# EAGLE design project2 (EAGLE 9.6.2)
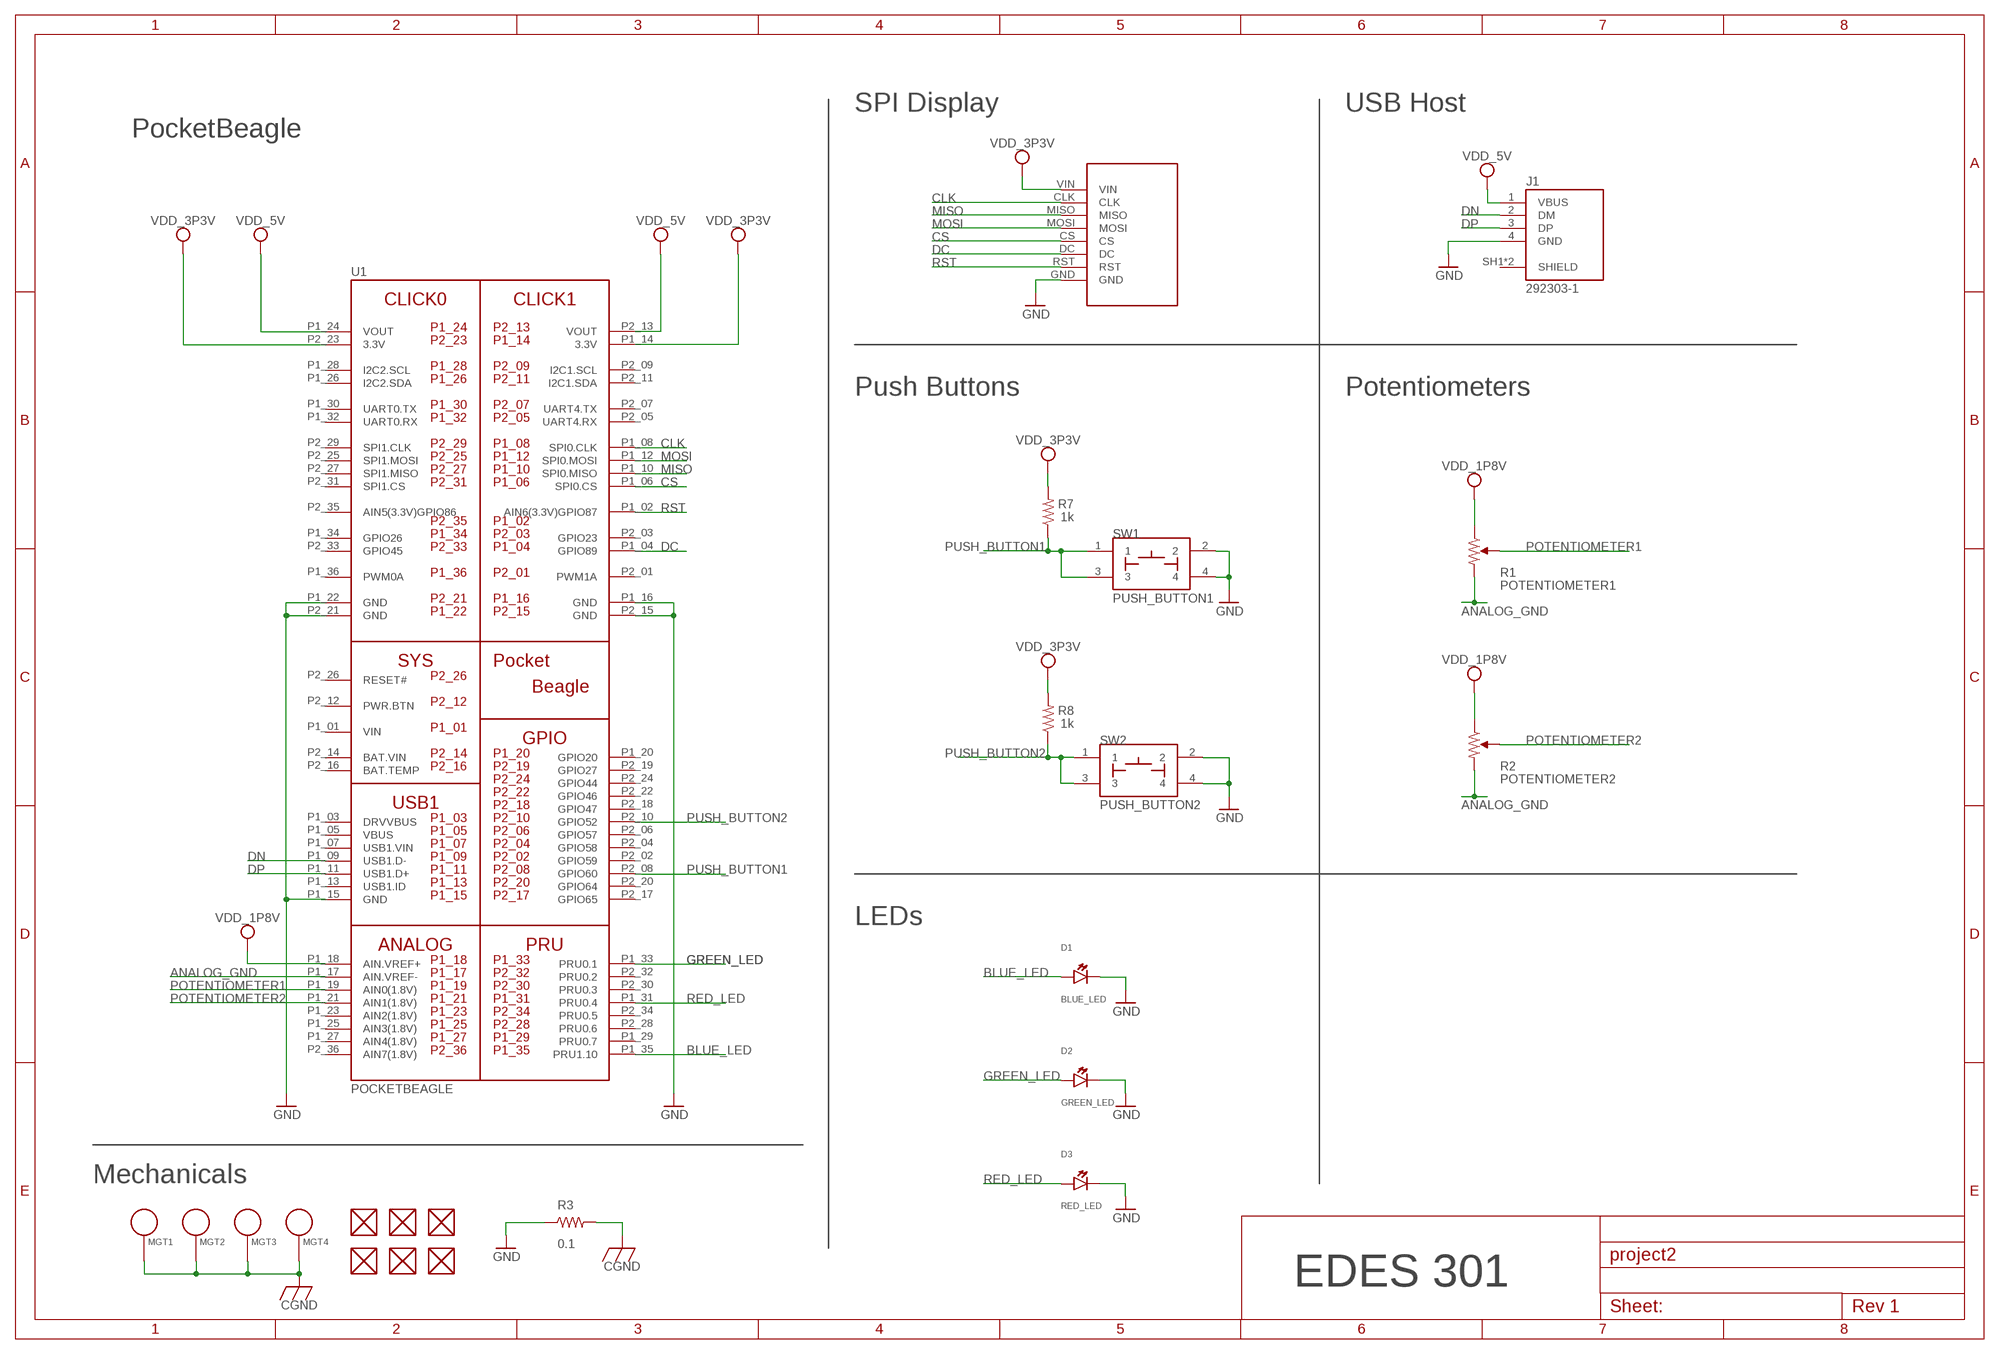
[diagram p0: schematic, sheet 1]

## Parts
D1  BLUE_LED  LED  [EIA-STD]
D2  GREEN_LED  LED  [EIA-STD]
D3  RED_LED  LED  [EIA-STD]
FUD1  FIDUCIAL  [FIDUCIAL_40MIL]
FUD2  FIDUCIAL  [FIDUCIAL_40MIL]
FUD3  FIDUCIAL  [FIDUCIAL_40MIL]
FUD4  FIDUCIAL  [FIDUCIAL_40MIL]
FUD5  FIDUCIAL  [FIDUCIAL_40MIL]
FUD6  FIDUCIAL  [FIDUCIAL_40MIL]
J1  292303-1  [TE_292303-1]
MGT1  MOUNTING_HOLE  [MOUNTING_HOLE]
MGT2  MOUNTING_HOLE  [MOUNTING_HOLE]
MGT3  MOUNTING_HOLE  [MOUNTING_HOLE]
MGT4  MOUNTING_HOLE  [MOUNTING_HOLE]
R1  POTENTIOMETER1  POTENTIOMETER  [POT-PO90S]
R2  POTENTIOMETER2  POTENTIOMETER  [POT-PO90S]
R3  0.1  R_R0805  [R0805]
R7  1k  R_R0603  [R0603]
R8  1k  R_R0603  [R0603]
SW1  PUSH_BUTTON1  PUSH_BUTTON  [BUTTON_12.5MM]
SW2  PUSH_BUTTON2  PUSH_BUTTON  [BUTTON_12.5MM]
U1  POCKETBEAGLE  [POCKETBEAGLE]
U$1  SCREEN  [SCREEN]

## Nets
ANALOG_GND: R1.CW R2.CW U1.P1_17(AIN.VREF-)
BLUE_LED: D1.ANODE U1.P1_35(PRU1.10)
CGND: MGT1.P$1 MGT2.P$1 MGT3.P$1 MGT4.P$1 R3.2
CLK: U1.P1_08(SPI0.CLK) U$1.CLK
CS: U1.P1_06(SPI0.CS) U$1.CS
DC: U1.P1_04(GPIO89) U$1.DC
DN: J1.2(DM) U1.P1_09(USB1.D-)
DP: J1.3(DP) U1.P1_11(USB1.D+)
GND: D2.CATHODE D3.CATHODE J1.4(GND) R3.1 SW1.2 SW1.4 SW2.2 SW2.4 U1.P1_15(GND) U1.P1_16(GND) U1.P1_22(GND) U1.P2_15(GND) U1.P2_21(GND) U$1.GND
GREEN_LED: D2.ANODE U1.P1_33(PRU0.1)
MISO: U1.P1_10(SPI0.MISO) U$1.MISO
MOSI: U1.P1_12(SPI0.MOSI) U$1.MOSI
N$1: D1.CATHODE ; supply symbol labelled GND
N$8: R7.2 ; supply symbol labelled VDD_3P3V
N$15: U1.P1_18(AIN.VREF+) ; supply symbol labelled VDD_1P8V
POTENTIOMETER1: R1.S U1.P1_19(AIN0(1.8V))
POTENTIOMETER2: R2.S U1.P1_21(AIN1(1.8V))
PUSH_BUTTON1: R7.1 SW1.1 SW1.3 U1.P2_08(GPIO60)
PUSH_BUTTON2: R8.1 SW2.1 SW2.3 U1.P2_10(GPIO52)
RED_LED: D3.ANODE U1.P1_31(PRU0.4)
RST: U1.P1_02(AIN6(3.3V)GPIO87) U$1.RST
VDD_1P8V: R1.CCW R2.CCW
VDD_3P3V: R8.2 U1.P1_14(3.3V) U1.P2_23(3.3V) U$1.VIN
VDD_5V: J1.1(VBUS) U1.P1_24(VOUT) U1.P2_13(VOUT)
Unconnected: FUD1.P$1 FUD2.P$1 FUD3.P$1 FUD4.P$1 FUD5.P$1 FUD6.P$1 J1.SH1(SHIELD) J1.SH2(SHIELD) U1.P1_03(DRVVBUS) U1.P1_05(VBUS) U1.P1_07(USB1.VIN) U1.P1_13(USB1.ID) U1.P1_20(GPIO20) U1.P1_23(AIN2(1.8V)) U1.P1_25(AIN3(1.8V)) U1.P1_26(I2C2.SDA) U1.P1_27(AIN4(1.8V)) U1.P1_28(I2C2.SCL) U1.P1_29(PRU0.7) U1.P1_30(UART0.TX) U1.P1_32(UART0.RX) U1.P1_34(GPIO26) U1.P1_36(PWM0A) U1.P2_01(PWM1A) U1.P2_02(GPIO59) U1.P2_03(GPIO23) U1.P2_04(GPIO58) U1.P2_05(UART4.RX) U1.P2_06(GPIO57) U1.P2_07(UART4.TX) U1.P2_09(I2C1.SCL) U1.P2_11(I2C1.SDA) U1.P2_12(PWR.BTN) U1.P2_16(BAT.TEMP) U1.P2_17(GPIO65) U1.P2_18(GPIO47) U1.P2_19(GPIO27) U1.P2_20(GPIO64) U1.P2_22(GPIO46) U1.P2_24(GPIO44) U1.P2_25(SPI1.MOSI) U1.P2_26(RESET#) U1.P2_27(SPI1.MISO) U1.P2_28(PRU0.6) U1.P2_29(SPI1.CLK) U1.P2_30(PRU0.3) U1.P2_31(SPI1.CS) U1.P2_32(PRU0.2) U1.P2_33(GPIO45) U1.P2_34(PRU0.5) U1.P2_35(AIN5(3.3V)GPIO86) U1.P2_36(AIN7(1.8V))

## Notes on the sheet
- SPI Display | USB Host
- PocketBeagle
- Push Buttons | Potentiometers
- LEDs
- Mechanicals
- EDES 301

## Power pins joined to a net without a drawn wire
BAT.VIN: U1.P2_14(BAT.VIN)
VIN: U1.P1_01(VIN)

## Library data of the parts
D1-D3 = combo_lock (1):LED: EIA-STD LED, LTST-C191TBKT
FUD1-FUD6 = combo_lock (1):FIDUCIAL
J1 = combo_lock (1):292303-1: CONN USB RECEPT R/A TYPE A 4POS Check availability <https://pricing.snapeda.com/parts/292303-1/TE%20Connectivity/view-part?ref=eda>; AVAILABILITY: In Stock; CENTERLINE_PITCH: 2 mm[.078 in]; COMMENT: 292303-1; DESCRIPTION: Conn; Data; USB; Recept; 2.0; 4 Pos; 1 Port; Rt Angle; A Ser; Tin over Copper; EU_ROHS_COMPLIANCE: Compliant; MF: TE Connectivity; MP: 292303-1; NUMBER_OF_POSITIONS: 4; PACKAGE: None; PRICE: None; PRODUCT_TYPE: Connector; PURCHASE-URL: https://pricing.snapeda.com/search/part/292303-1/?ref=eda
MGT1-MGT4 = combo_lock (1):MOUNTING_HOLE: Chassis Mounting Hole w/GND connection ability
R1 R2 = combo_lock (1):POTENTIOMETER: Potentiometer - Examples: P090S-14T20BR10K (987-1277-ND)
R3 R7 R8 = combo_lock (1):R_: RESISTOR, American symbol
SW1 SW2 = combo_lock (1):PUSH_BUTTON
U1 = combo_lock (1):POCKETBEAGLE
U$1 = combo_lock (1):SCREEN

## Board
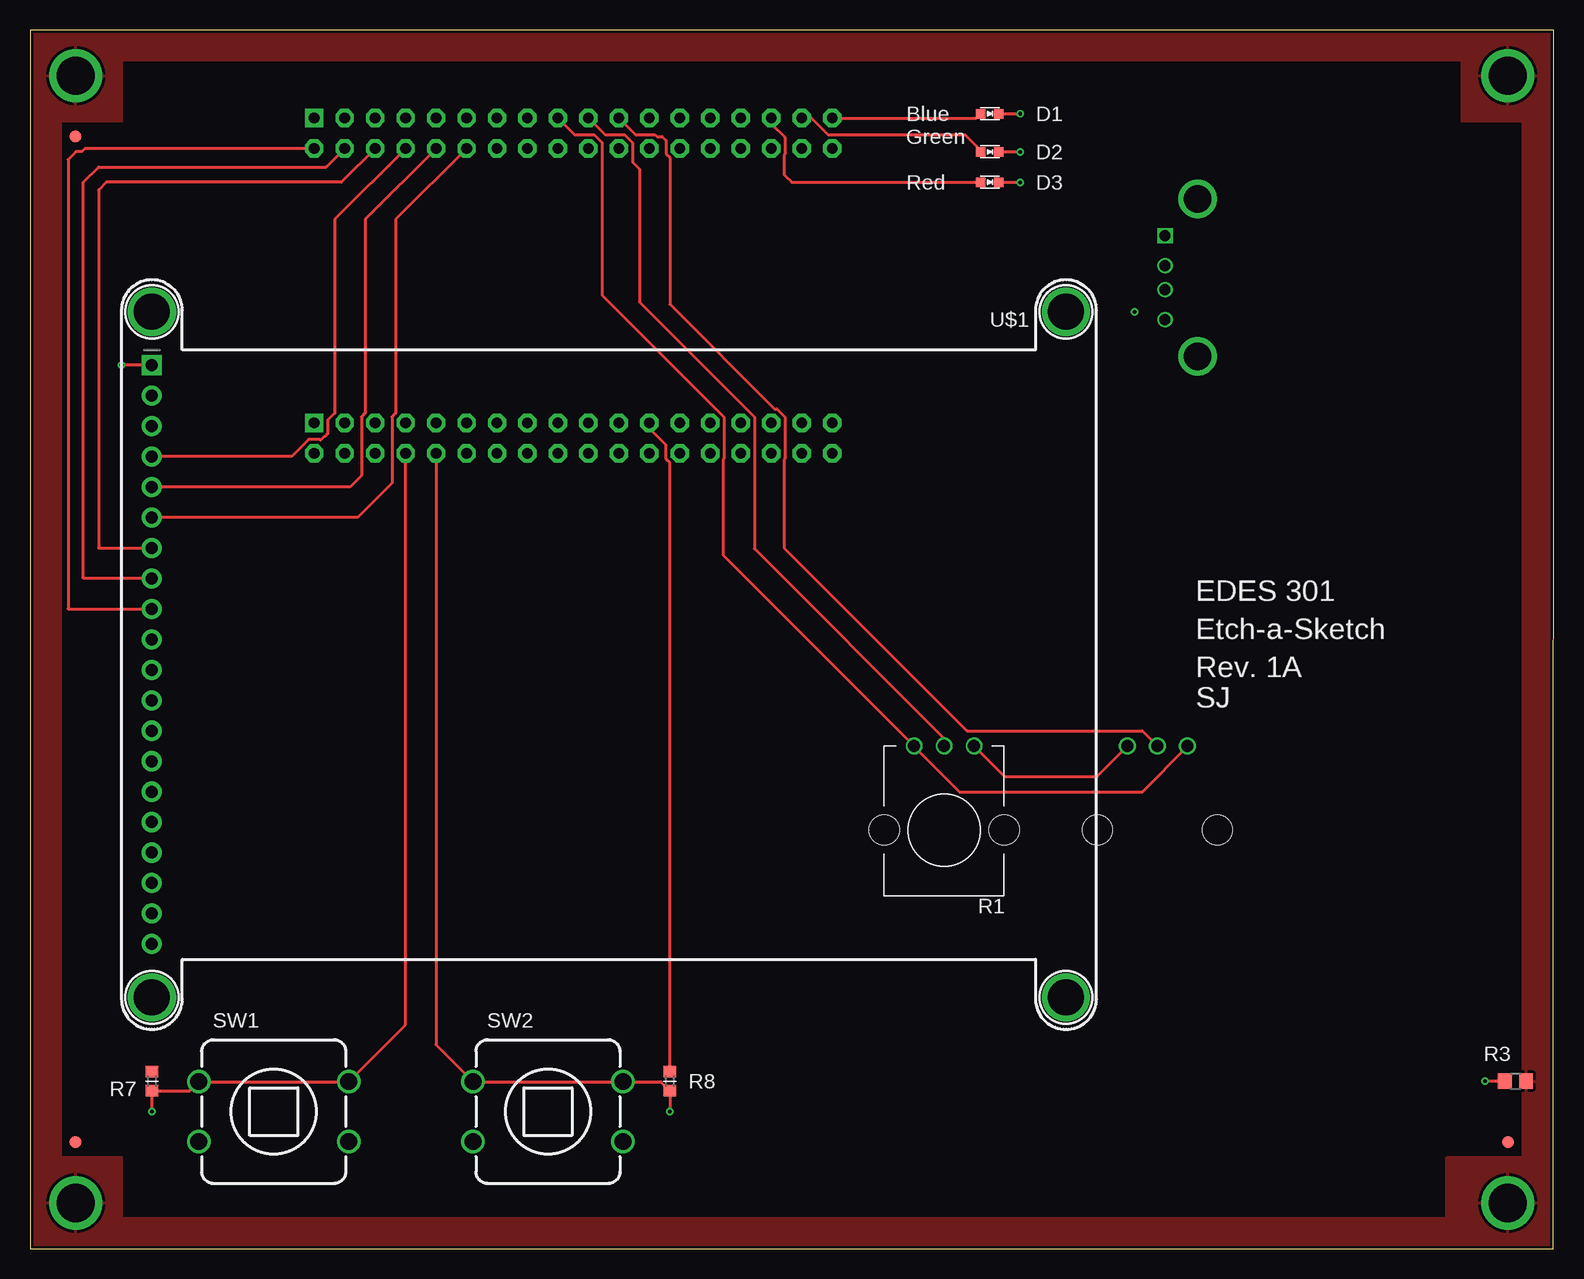
[diagram p1: board, top side]
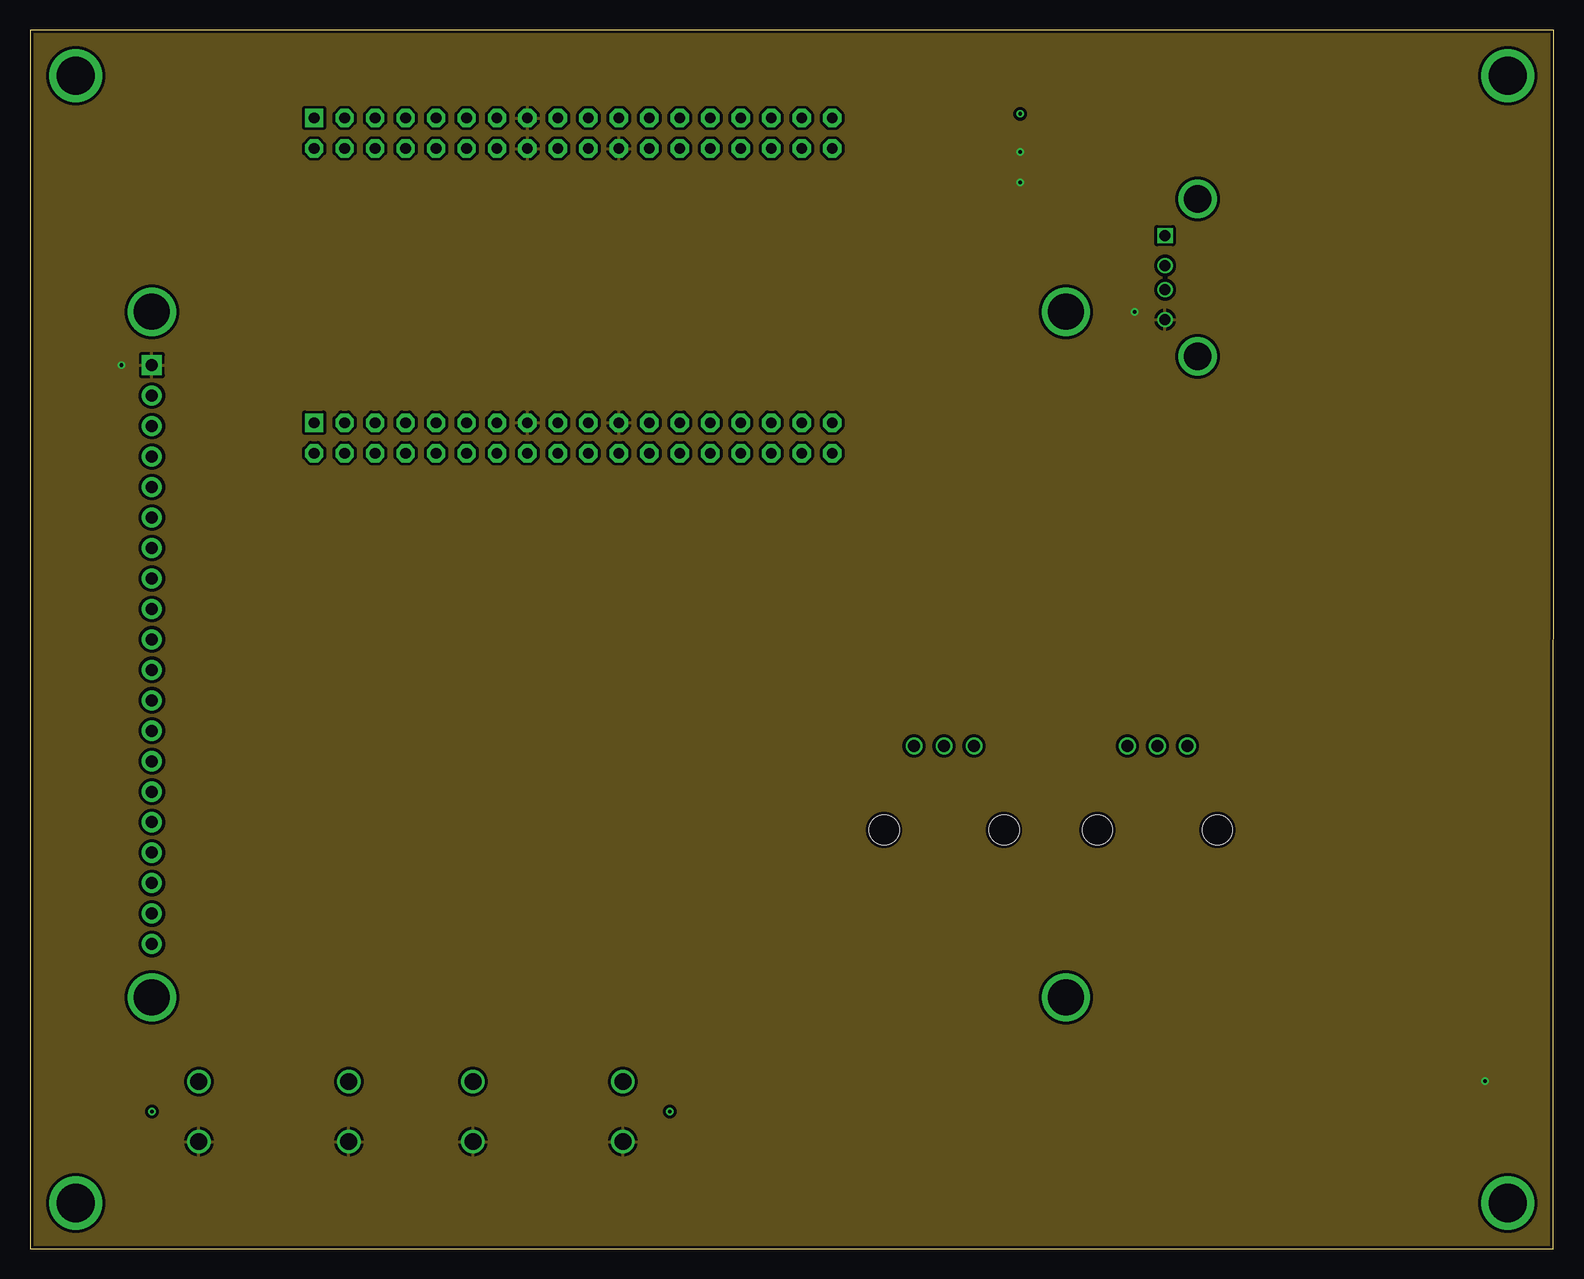
[diagram p2: board, inner layer Route2]
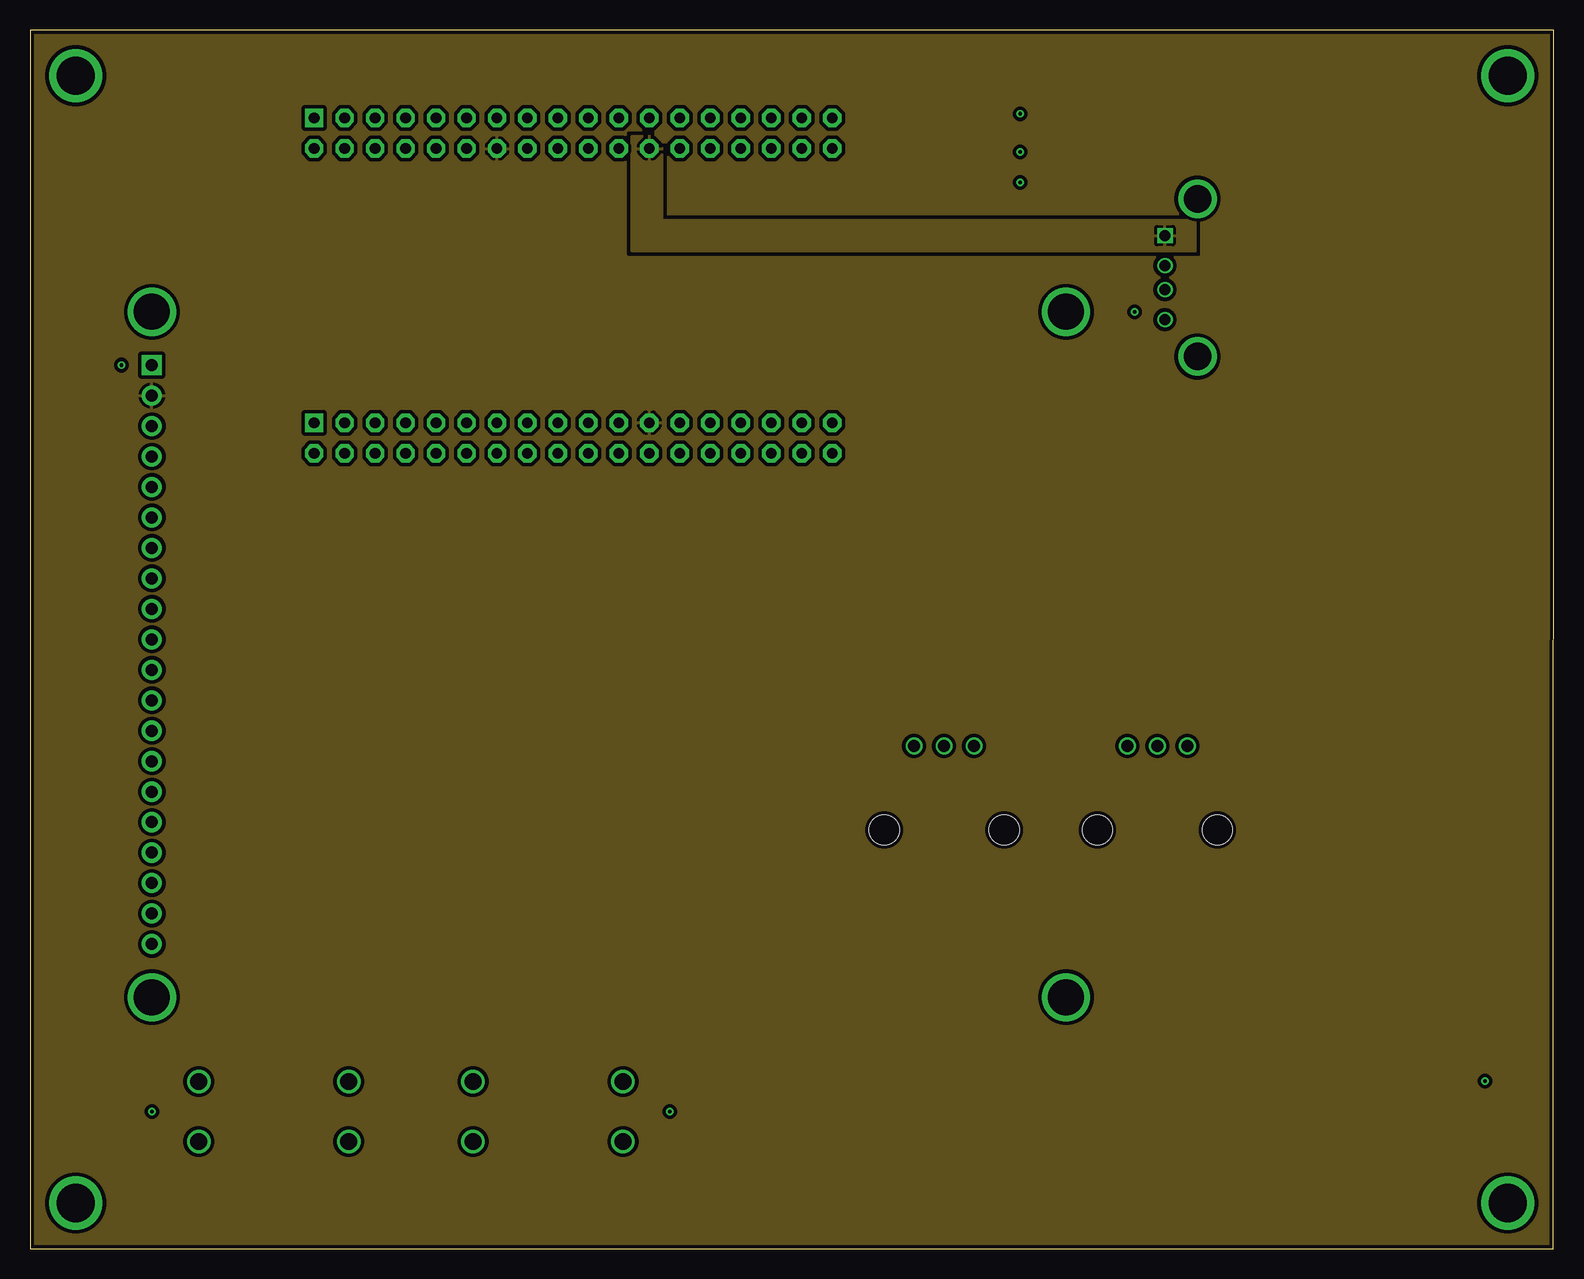
[diagram p3: board, inner layer Route15]
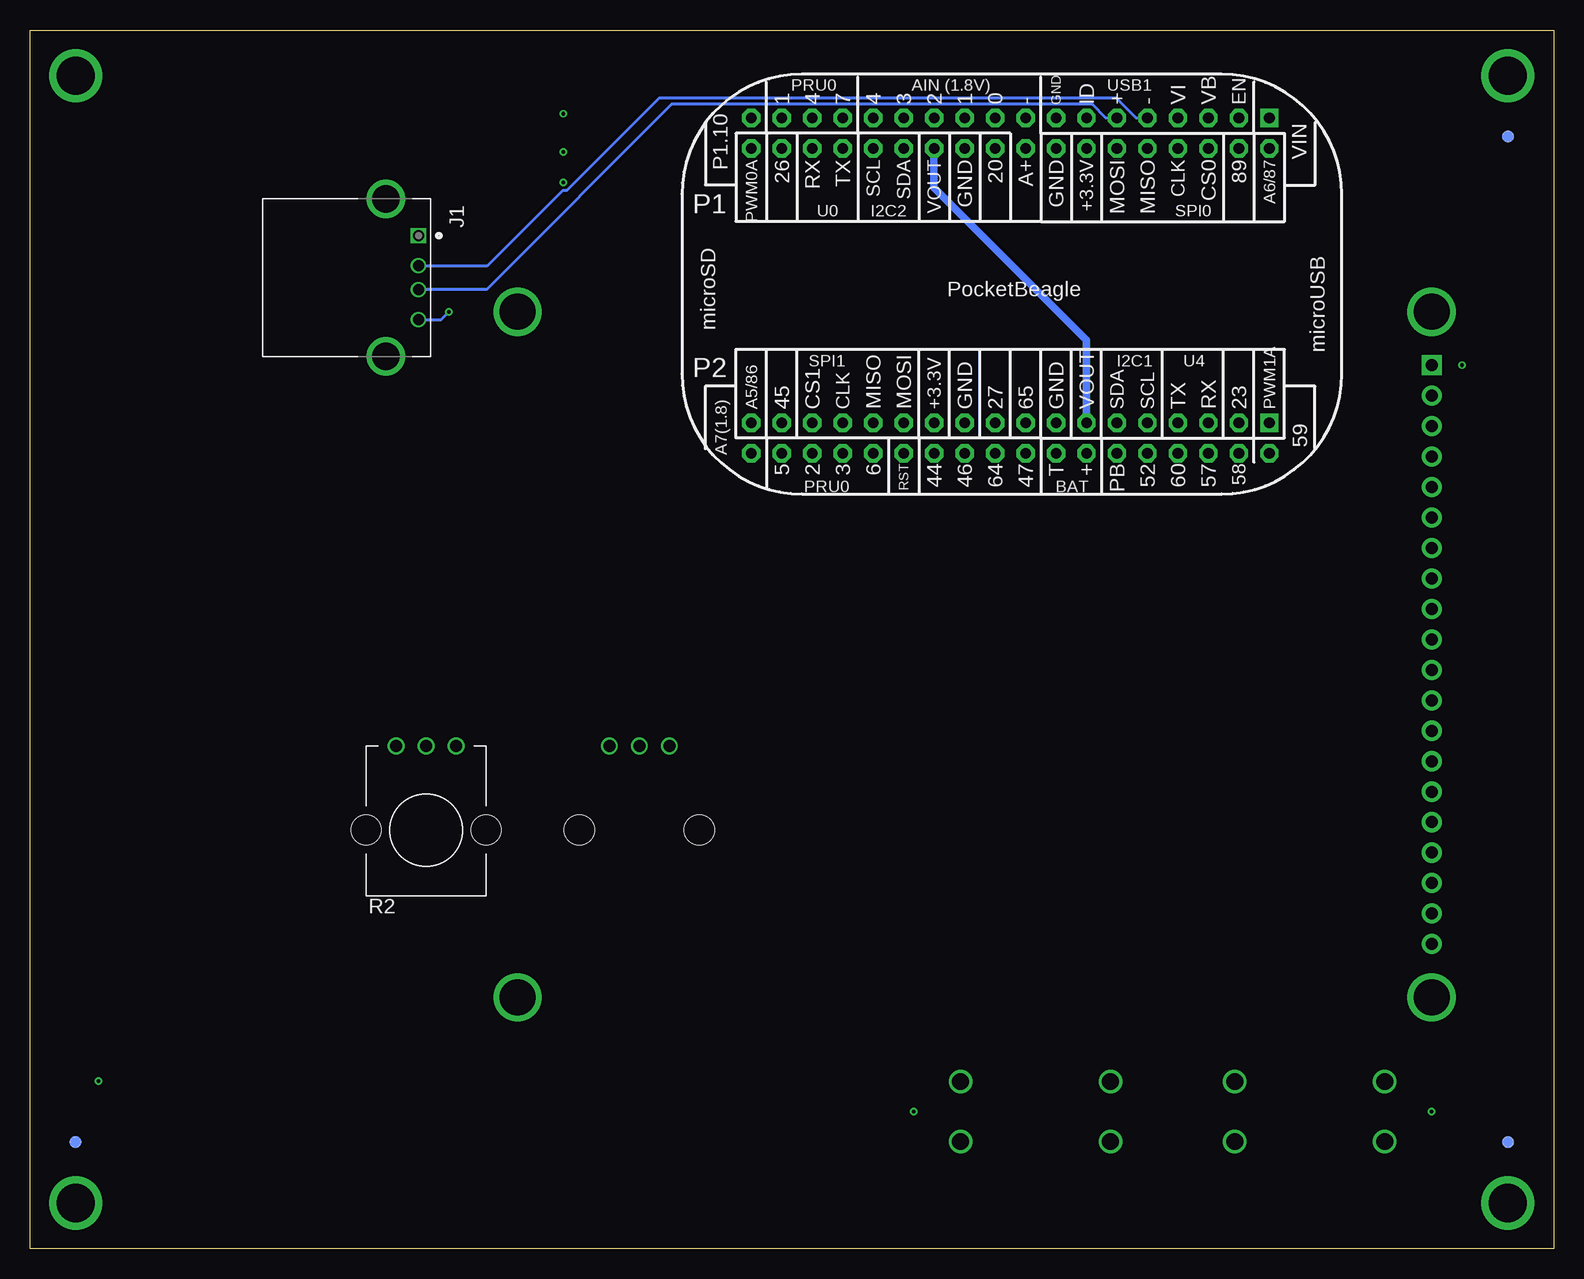
[diagram p4: board, bottom side, seen from below]

Size 127 x 101.6 mm. Coordinates in mm from the lower left corner, seen from the top.
Outline: 0,0 126.98,0 127,101.6 0,101.6 0,0
Copper layers (1*2*15*16): Top 0.035mm / dielectric 0.23mm / Route2 0.035mm / dielectric 0.93mm / Route15 0.035mm / dielectric 0.23mm / Bottom 0.035mm
Design rules "EDES301_4lyr (1)": minimum track width 10mil, minimum drill 12mil, track to track 10mil, track to pad 10mil, pad to pad 10mil, via to via 10mil, smd to smd 10mil, copper to edge 10mil, drill to drill 12mil, minimum pad ring 6mil, minimum via ring 6mil, stop-mask expansion 3mil, vias tented up to drill 25mil, thermal gap 10mil

### Footprints (pad centres in the part's own frame; a part is rotated, then mirrored left to right if it is on the bottom)
EIA-STD = smd 0.8 x 0.8: ANODE -0.75,0; CATHODE 0.75,0
FIDUCIAL_40MIL = smd 1.016 x 1.016: P$1 0,0
TE_292303-1 = drill 0.92 square: 1 0,0 | drill 0.92: 2 2.5,0; 3 4.5,0; 4 7,0 | drill 2.3: SH1 -3.07,-2.71; SH2 10.07,-2.71
MOUNTING_HOLE = drill 3.175 pad 4.445: P$1 0,0
POT-PO90S = drill 1: CCW -2.5,0; CW 2.5,0; S 0,0 | hole 2.5: -5,7; 5,7
R0805 = smd 1.143 x 1.27: 1 -0.889,0; 2 0.889,0
R0603 = smd 0.95 x 1.031: 1 -0.8,0; 2 0.8,0
BUTTON_12.5MM = drill 1.4: 1 -6.25,2.5; 2 -6.25,-2.5; 3 6.25,2.5; 4 6.25,-2.5
POCKETBEAGLE = drill 0.889 pad 1.524 square: P1_01 5.91,3.53; P2_01 5.91,28.93 | drill 0.889 pad 1.524 octagon: P1_02 5.91,6.07; P1_03 8.45,3.53; P1_04 8.45,6.07; P1_05 10.99,3.53; P1_06 10.99,6.07; P1_07 13.53,3.53; P1_08 13.53,6.07; P1_09 16.07,3.53; P1_10 16.07,6.07; P1_11 18.61,3.53; P1_12 18.61,6.07; P1_13 21.15,3.53; P1_14 21.15,6.07; P1_15 23.69,3.53; P1_16 23.69,6.07; P1_17 26.23,3.53; P1_18 26.23,6.07; P1_19 28.77,3.53; P1_20 28.77,6.07; P1_21 31.31,3.53; P1_22 31.31,6.07; P1_23 33.85,3.53; P1_24 33.85,6.07; P1_25 36.39,3.53; P1_26 36.39,6.07; P1_27 38.93,3.53; P1_28 38.93,6.07; P1_29 41.47,3.53; P1_30 41.47,6.07; P1_31 44.01,3.53; P1_32 44.01,6.07; P1_33 46.55,3.53; P1_34 46.55,6.07; P1_35 49.09,3.53; P1_36 49.09,6.07; P2_02 5.91,31.47; P2_03 8.45,28.93; P2_04 8.45,31.47; P2_05 10.99,28.93; P2_06 10.99,31.47; P2_07 13.53,28.93; P2_08 13.53,31.47; P2_09 16.07,28.93; P2_10 16.07,31.47; P2_11 18.61,28.93; P2_12 18.61,31.47; P2_13 21.15,28.93; P2_14 21.15,31.47; P2_15 23.69,28.93; P2_16 23.69,31.47; P2_17 26.23,28.93; P2_18 26.23,31.47; P2_19 28.77,28.93; P2_20 28.77,31.47; P2_21 31.31,28.93; P2_22 31.31,31.47; P2_23 33.85,28.93; P2_24 33.85,31.47; P2_25 36.39,28.93; P2_26 36.39,31.47; P2_27 38.93,28.93; P2_28 38.93,31.47; P2_29 41.47,28.93; P2_30 41.47,31.47; P2_31 44.01,28.93; P2_32 44.01,31.47; P2_33 46.55,28.93; P2_34 46.55,31.47; P2_35 49.09,28.93; P2_36 49.09,31.47
SCREEN = drill 1 pad 1.676: 3VO -19.05,-38.1; 12@JP2 3.81,-38.1; 13@JP2 6.35,-38.1; 14@JP2 8.89,-38.1; 15@JP2 11.43,-38.1; 16@JP2 13.97,-38.1; 17@JP2 16.51,-38.1; 18@JP2 19.05,-38.1; 19@JP2 21.59,-38.1; 20@JP2 24.13,-38.1; CLK -16.51,-38.1; CS -8.89,-38.1; DC -6.35,-38.1; GND@1 1.27,-38.1; LITE -1.27,-38.1; MISO -13.97,-38.1; MOSI -11.43,-38.1; RST -3.81,-38.1; VIN -21.59,-38.1 | drill 1 pad 1.676 square: GND -24.13,-38.1 | drill 3 pad 3.6: P$1@U$7 -28.575,-38.1; P$1@U$15 28.575,-38.1; P$1@U$16 -28.575,38.1; P$1@U$17 28.575,38.1

### Placement (x,y rotation side)
D1  80.01,94.61 0 top
D2  80.01,91.44 0 top
D3  80.01,88.9 0 top
FUD1  3.81,8.89 0 top
FUD2  3.81,92.71 0 top
FUD3  123.19,8.89 0 top
FUD4  3.81,8.89 0 bottom
FUD5  3.81,92.71 0 bottom
FUD6  123.19,8.89 0 bottom
J1  94.61,84.45 270 bottom
MGT1  3.81,3.81 0 top
MGT2  3.81,97.79 0 top
MGT3  123.19,97.79 0 top
MGT4  123.19,3.81 0 top
R1  76.2,41.91 180 top
R2  93.98,41.91 180 bottom
R3  123.83,13.97 0 top
R7  10.16,13.97 90 top
R8  53.34,13.97 90 top
SW1  20.32,11.43 0 top
SW2  43.18,11.43 0 top
U1  17.78,97.79 180 bottom
U$1  48.26,49.53 270 top

### Tracks (layer width: path | path; a pad name or v marks a point on that pad's centre or on a via)
ANALOG_GND
  Top 0.254: U1.P1_17 45.41,92.86 47.02,92.86 47.69,92.19 47.69,79.49 57.85,69.33 57.85,65.85 57.78,65.78 57.78,57.83 R1.CW 73.7,41.87 77.47,38.1 92.71,38.1 96.48,41.87 R2.CW
BLUE_LED
  Top 0.254: U1.P1_35 78.91,94.26 D1.ANODE
CGND
  pour Top: -2.54,50.8 2.54,50.8 2.54,7.62 7.62,7.62 7.62,2.54 118.11,2.54 118.11,7.62 124.46,7.62 124.46,50.8 129.54,50.8 129.54,-2.54 -2.54,-2.54
  pour Top: -2.54,50.8 -2.54,104.14 129.54,104.14 129.54,50.8 124.46,50.8 124.46,93.98 119.38,93.98 119.38,99.06 7.62,99.06 7.62,93.98 2.54,93.98 2.54,50.8
CLK
  Top 0.254: U1.P1_08 25.4,85.81 25.4,69.65 24.83,69.08 24.83,67.94 24.61,67.72 24.54,67.72 24.22,67.4 24.16,67.46 23.22,67.46 21.79,66.04 U$1.CLK
CS
  Top 0.254: U1.P1_06 25.95,88.9 6.35,88.9 5.71,88.27 5.71,58.42 U$1.CS
DC
  Top 0.254: U1.P1_04 24.68,90.17 5.71,90.17 4.45,88.9 4.45,55.88 U$1.DC
DN
  Bottom 0.254: U1.P1_09 34.77,94.26 36.42,95.91 74.57,95.91 82.27,88.21 82.6,88.21 88.9,81.92 94.58,81.92 J1.2
DP
  Bottom 0.254: U1.P1_11 37.31,94.26 38.46,95.4 73.51,95.4 88.95,79.95 J1.3
GND  (via drill 0.3 pad 0.61)
  Top 0.254: D2.CATHODE v82.55,91.44 | D3.CATHODE v82.55,88.9 | R3.1 v121.28,13.97 | U$1.GND v7.62,73.66
  Bottom 0.254: J1.4 92.72,77.45 v92.08,78.11
  pour Route2: -5.08,-2.54 -5.08,106.68 132.08,106.68 132.08,-5.08 -5.08,-5.08
GREEN_LED
  Top 0.254: U1.P1_33 65.12,94.26 66.52,92.86 77.95,92.86 79.26,91.56 D2.ANODE
MISO
  Top 0.254: U1.P1_10 27.94,85.81 27.94,69.65 27.63,69.33 27.63,64.46 26.67,63.5 U$1.MISO
MOSI
  Top 0.254: U1.P1_12 30.48,85.81 30.48,69.65 30.17,69.33 30.17,63.82 27.3,60.96 U$1.MOSI
N$1  (via drill 0.3 pad 0.61)
  Top 0.254: D1.CATHODE v82.55,94.61
POTENTIOMETER1
  Top 0.254: U1.P1_19 47.95,92.86 49.56,92.86 50.23,92.19 50.23,90.58 50.8,90.01 50.8,78.93 60.39,69.33 60.39,58.35 76.2,42.55 R1.S
POTENTIOMETER2
  Top 0.254: U1.P1_21 50.49,92.86 52.1,92.86 52.26,92.71 52.7,92.71 53.03,92.39 53.03,91.25 53.34,90.93 53.34,78.74 62.08,70 62.26,70 62.93,69.33 62.93,65.85 62.87,65.78 62.87,58.42 78.11,43.18 92.71,43.18 R2.S
PUSH_BUTTON1  (via drill 0.3 pad 0.61)
  Top 0.254: v10.16,11.43 R7.1 13.31,13.17 SW1.1 SW1.3 31.31,18.67 U1.P2_08
PUSH_BUTTON2  (via drill 0.3 pad 0.61)
  Top 0.254: v53.34,11.43 R8.1 52.58,13.93 SW2.3 SW2.1 33.85,17.01 U1.P2_10
RED_LED
  Top 0.254: U1.P1_31 61.79,93.78 62.93,92.64 62.93,91.25 62.87,91.18 62.87,89.53 63.5,88.9 D3.ANODE
RST
  Top 0.254: U1.P1_02 4.57,91.72 4.32,91.47 3.84,91.47 3.17,90.81 3.17,53.34 U$1.RST
VDD_1P8V
  Top 0.254: R1.CCW 81.24,39.37 88.94,39.37 R2.CCW
VDD_3P3V
  Top 0.254: R8.2 53.34,65.53 53.03,65.85 53.03,66.99 51.63,68.39 U1.P2_23
  pour Route15 (isolate 0.305, rank 6): -7.62,-7.62 -7.62,109.22 134.62,109.22 134.62,-7.62
VDD_5V
  Bottom 0.635: U1.P2_13 38.93,75.76 51.63,88.46 U1.P1_24
  pour Route15: 50.16,92.71 50.16,83.19 97.16,83.19 97.16,85.72 52.7,85.72 52.7,92.71

### Text on the board
tPlace: Blue | Green | Red | EDES 301 | Etch-a-Sketch | Rev. 1A | SJ